# EAGLE schematic mazeModule (EAGLE 9.6.2)
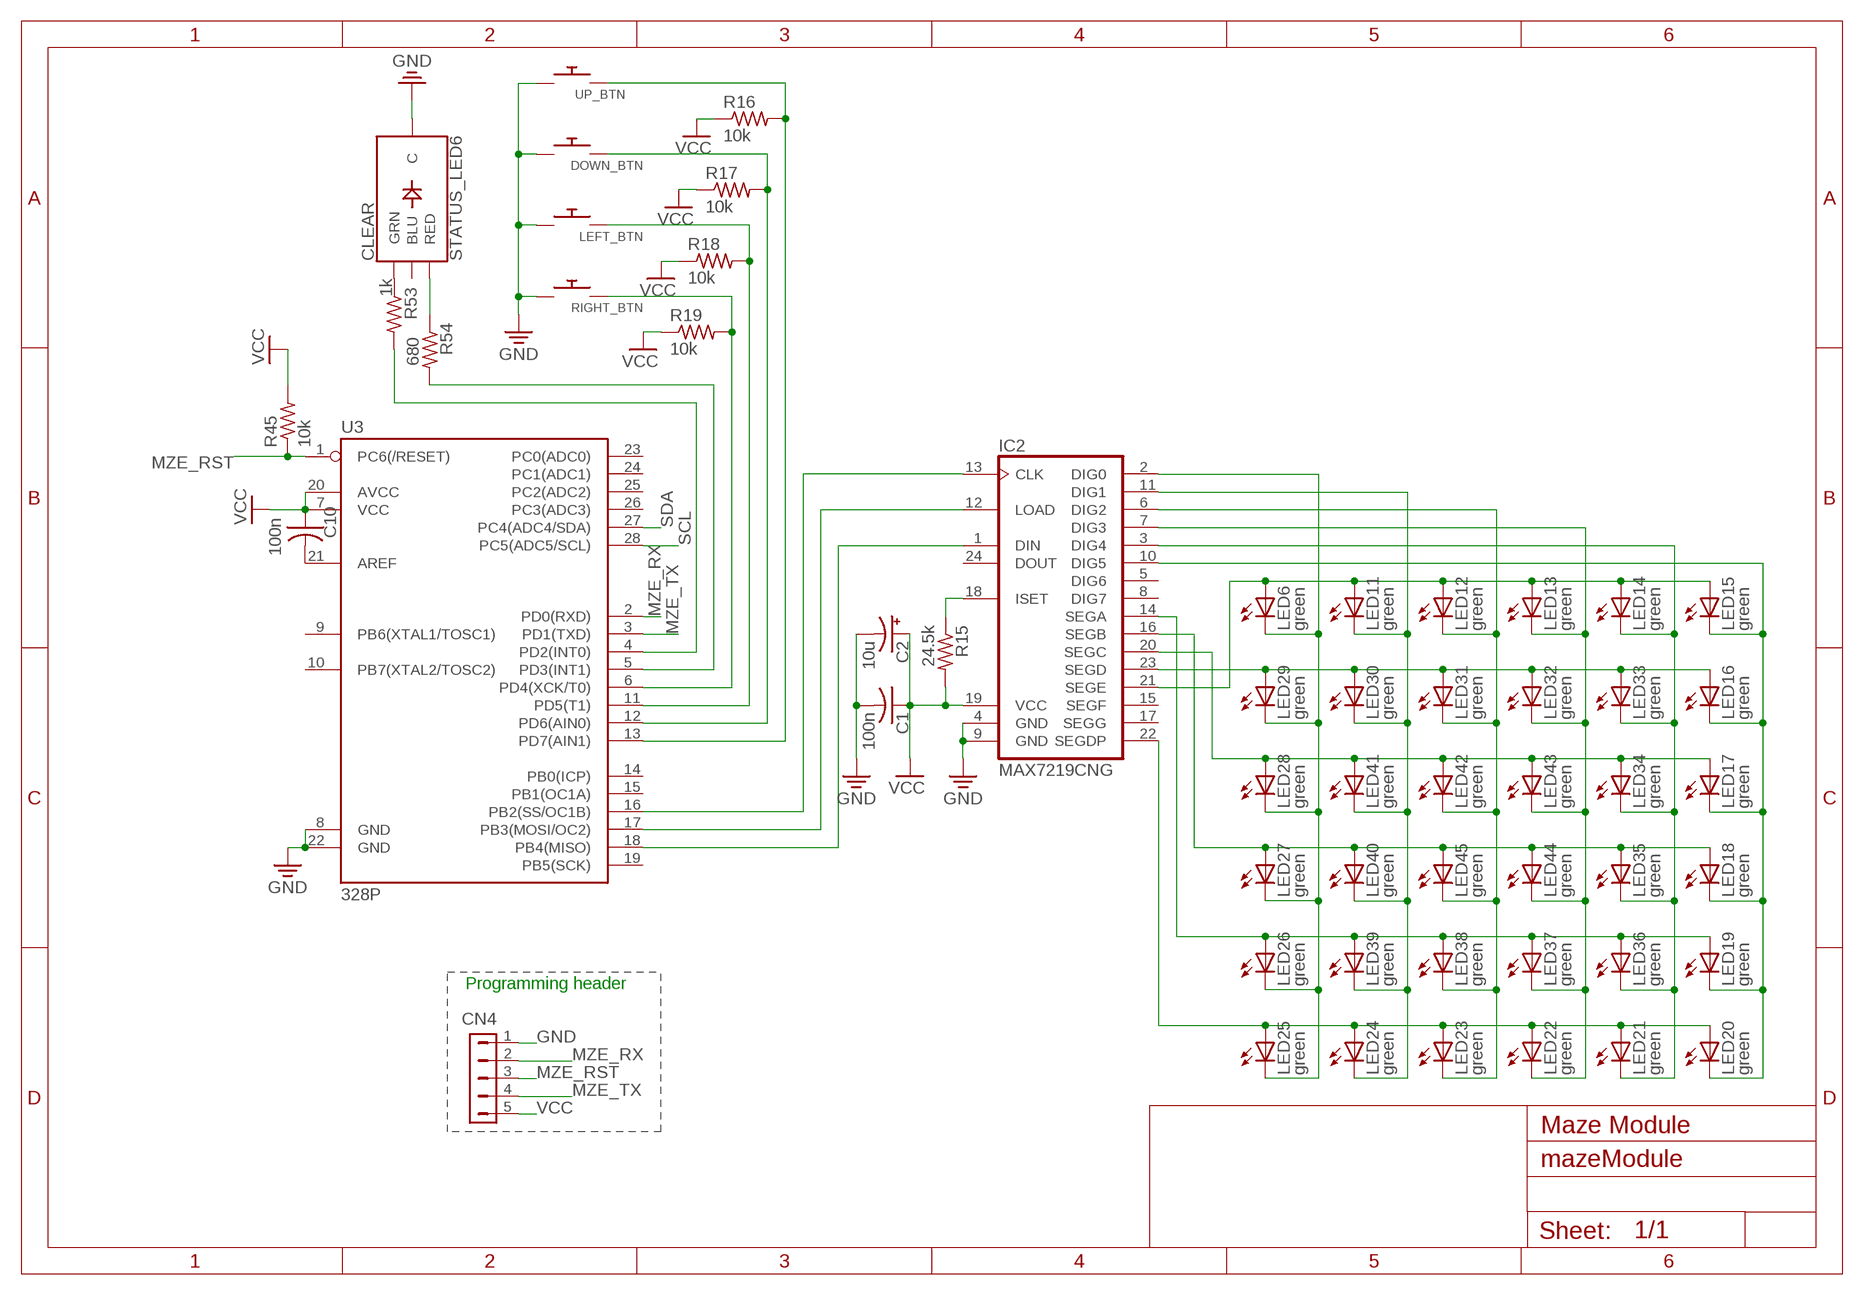
[diagram p0: schematic, sheet 1]

## Parts
C1  100n  C-US025-024X044  [C025-024X044]
C2  10u  CPOL-US085CS-1AR  [085CS_1AR]
C10  100n  C-US025-024X044  [C025-024X044]
CN4  HDR-1X5-SIP-100  [SIP-100-5V]
DOWN_BTN  SWITCH_PUSHBUTTONEVQ-PE  [TACT_PANA-EVQ]
IC2  MAX7219CNG  [DIL24-3]
LED6  green  LED5MM  [LED5MM]
LED11  green  LED5MM  [LED5MM]
LED12  green  LED5MM  [LED5MM]
LED13  green  LED5MM  [LED5MM]
LED14  green  LED5MM  [LED5MM]
LED15  green  LED5MM  [LED5MM]
LED16  green  LED5MM  [LED5MM]
LED17  green  LED5MM  [LED5MM]
LED18  green  LED5MM  [LED5MM]
LED19  green  LED5MM  [LED5MM]
LED20  green  LED5MM  [LED5MM]
LED21  green  LED5MM  [LED5MM]
LED22  green  LED5MM  [LED5MM]
LED23  green  LED5MM  [LED5MM]
LED24  green  LED5MM  [LED5MM]
LED25  green  LED5MM  [LED5MM]
LED26  green  LED5MM  [LED5MM]
LED27  green  LED5MM  [LED5MM]
LED28  green  LED5MM  [LED5MM]
LED29  green  LED5MM  [LED5MM]
LED30  green  LED5MM  [LED5MM]
LED31  green  LED5MM  [LED5MM]
LED32  green  LED5MM  [LED5MM]
LED33  green  LED5MM  [LED5MM]
LED34  green  LED5MM  [LED5MM]
LED35  green  LED5MM  [LED5MM]
LED36  green  LED5MM  [LED5MM]
LED37  green  LED5MM  [LED5MM]
LED38  green  LED5MM  [LED5MM]
LED39  green  LED5MM  [LED5MM]
LED40  green  LED5MM  [LED5MM]
LED41  green  LED5MM  [LED5MM]
LED42  green  LED5MM  [LED5MM]
LED43  green  LED5MM  [LED5MM]
LED44  green  LED5MM  [LED5MM]
LED45  green  LED5MM  [LED5MM]
LEFT_BTN  SWITCH_PUSHBUTTONEVQ-PE  [TACT_PANA-EVQ]
R15  24.5k  R-US_0309/12  [0309/12]
R16  10k  R-US_0309/12  [0309/12]
R17  10k  R-US_0309/12  [0309/12]
R18  10k  R-US_0309/12  [0309/12]
R19  10k  R-US_0309/12  [0309/12]
R45  10k  R-US_0309/12  [0309/12]
R53  1k  FLIPFLOP-RES  [0805-THM]
R54  680  FLIPFLOP-RES  [0805-THM]
RIGHT_BTN  SWITCH_PUSHBUTTONEVQ-PE  [TACT_PANA-EVQ]
STATUS_LED6  CLEAR  LED-RGB-CCCLEAR  [LED-RGB-THRU]
U3  328P  ATMEGA328P_PDIP  [DIP28]
UP_BTN  SWITCH_PUSHBUTTONEVQ-PE  [TACT_PANA-EVQ]

## Nets
GND: C1.2 C2.- CN4.1 DOWN_BTN.P$1 IC2.4(GND) IC2.9(GND) LEFT_BTN.P$1 RIGHT_BTN.P$1 STATUS_LED6.2(C) U3.8(GND) U3.22(GND) UP_BTN.P$1
MZE_RST: CN4.3 R45.1 U3.1(PC6(/RESET))
MZE_RX: CN4.2 U3.2(PD0(RXD))
MZE_TX: CN4.4 U3.3(PD1(TXD))
N$36: IC2.22(SEGDP) LED20.A LED21.A LED22.A LED23.A LED24.A LED25.A
N$40: IC2.14(SEGA) LED19.A LED26.A LED36.A LED37.A LED38.A LED39.A
N$41: IC2.16(SEGB) LED18.A LED27.A LED35.A LED40.A LED44.A LED45.A
N$42: IC2.20(SEGC) LED17.A LED28.A LED34.A LED41.A LED42.A LED43.A
N$49: IC2.2(DIG0) LED6.K(C) LED25.K(C) LED26.K(C) LED27.K(C) LED28.K(C) LED29.K(C)
N$50: IC2.21(SEGE) LED11.A LED12.A LED13.A LED14.A LED15.A
N$52: IC2.23(SEGD) LED16.A LED29.A LED30.A LED31.A LED32.A LED33.A
N$53: R16.2 U3.13(PD7(AIN1)) UP_BTN.P$2
N$54: IC2.11(DIG1) LED11.K(C) LED24.K(C) LED30.K(C) LED39.K(C) LED40.K(C) LED41.K(C)
N$55: IC2.6(DIG2) LED12.K(C) LED23.K(C) LED31.K(C) LED38.K(C) LED42.K(C) LED45.K(C)
N$56: IC2.7(DIG3) LED13.K(C) LED22.K(C) LED32.K(C) LED37.K(C) LED43.K(C) LED44.K(C)
N$57: IC2.3(DIG4) LED14.K(C) LED21.K(C) LED33.K(C) LED34.K(C) LED35.K(C) LED36.K(C)
N$58: IC2.10(DIG5) LED15.K(C) LED16.K(C) LED17.K(C) LED18.K(C) LED19.K(C) LED20.K(C)
N$59: DOWN_BTN.P$2 R17.2 U3.12(PD6(AIN0))
N$60: LEFT_BTN.P$2 R18.2 U3.11(PD5(T1))
N$61: IC2.18(ISET) R15.1
N$62: R19.2 RIGHT_BTN.P$2 U3.6(PD4(XCK/T0))
N$63: IC2.1(DIN) U3.18(PB4(MISO))
N$64: IC2.13(CLK) U3.16(PB2(SS/OC1B))
N$65: IC2.12(LOAD) U3.17(PB3(MOSI/OC2))
N$67: R54.2 U3.5(PD3(INT1))
N$68: R53.2 U3.4(PD2(INT0))
N$138: C10.2 U3.21(AREF)
N$149: R53.1 STATUS_LED6.3(GRN)
N$150: R54.1 STATUS_LED6.1(RED)
SCL: U3.28(PC5(ADC5/SCL))
SDA: U3.27(PC4(ADC4/SDA))
VCC: C1.1 C2.+ C10.1 CN4.5 IC2.19(VCC) R15.2 R16.1 R17.1 R18.1 R19.1 R45.2 U3.7(VCC) U3.20(AVCC)
VCC2: LED6.A
Unconnected: IC2.5(DIG6) IC2.8(DIG7) IC2.15(SEGF) IC2.17(SEGG) IC2.24(DOUT) STATUS_LED6.4(BLU) U3.9(PB6(XTAL1/TOSC1)) U3.10(PB7(XTAL2/TOSC2)) U3.14(PB0(ICP)) U3.15(PB1(OC1A)) U3.19(PB5(SCK)) U3.23(PC0(ADC0)) U3.24(PC1(ADC1)) U3.25(PC2(ADC2)) U3.26(PC3(ADC3))

## Notes on the sheet
- Programming header
- Maze Module

## Library data of the parts
C1 C10 = adafruit:C-US: CAPACITOR, American symbol
C2 = adafruit:CPOL-US: POLARIZED CAPACITOR, American symbol
CN4 = con-hdrs40:HDR-1X5: HEADER CONNECTOR
DOWN_BTN LEFT_BTN RIGHT_BTN UP_BTN = adafruit:SWITCH_PUSHBUTTON: Buttons SOFTTOUCHSMD_SJ - Soft touch temporary push button (Super Junk Akihabara) Compatible with SKPMANE010 [Mouser: 688-SKPMAN] C&K_KSS = Digikey: KSS221GLFS
IC2 = maxim:MAX7219CNG: LED DISPLAY DRIVER; MF: MAXIM; MPN: MAX7219CNG; OC_FARNELL: 1523914; OC_NEWARK: 34C4018
LED6 LED11-LED45 = adafruit:LED: LED OSRAM: - CHIPLED LG R971, LG N971, LY N971, LG Q971, LY Q971, LO R971, LY R971 LH N974, LH R974 LS Q976, LO Q976, LY Q976 LO Q996 - Hyper CHIPLED LW Q18S LB Q993, LB Q99A, LB R99A - SideLED LS A670, LO A670, LY A670, LG A670, LP A670 LB A673, LV A673, LT A673, LW A673 LH A674 LY A675 LS A676, LA A676, LO A676, LY A676, LW A676 LS A679, LY A679, LG A679 - Hyper Micro SIDELED® LS Y876, LA Y876, LO Y876, LY Y876 LT Y87S - SmartLED LW L88C, LW L88S LB L89C, LB L89S, LG L890 LS L89K, LO L89K, LY L89K LS L896, LA L896, LO L896, LY L896 - TOPLED LS T670, LO T670, LY T670, LG T670, LP T670 LSG T670, LSP T670, LSY T670, LOP T670, LYG T670 LG T671, LOG T671, LSG T671 LB T673, LV T673, LT T673, LW T673 LH T674 LS T676, LA T676, LO T676, LY T676, LB T676, LH T676, LSB T676, LW T676 LB T67C, LV T67C, LT T67C, LS T67K, LO T67K, LY T67K, LW E67C LS E67B, LA E67B, LO E67B, LY E67B, LB E67C, LV E67C, LT E67C LW T67C LS T679, LY T679, LG T679 LS T770, LO T770, LY T770, LG T770, LP T770 LB T773, LV T773, LT T773, LW T773 LH T774 LS E675, LA E675, LY E675, LS T675 LS T776, LA T776, LO T776, LY T776, LB T776 LHGB T686 LT T68C, LB T68C - Hyper Mini TOPLED® LB M676 - Mini TOPLED Santana® LG M470 LS M47K, LO M47K, LY M47K Source: http://www.osram.convergy.de/
R15-R19 R45 = adafruit:R-US_: RESISTOR, American symbol
R53 R54 = adafruit:FLIPFLOP-RES: Flip Flop resistor An 0805 resistor inside a standard 1/4W 5% resistor. Makes for easy mods
STATUS_LED6 = SparkFun-LED:LED-RGB-CC: LED-RGB Common Cathode Packages: LED RGB-THRU LED_PIRANHA_5MM SparkFun Products: RGB Diffused Common Cathode- Diffuse <[https://www.sparkfun.com/products/9264]> RGB Diffused Common Cathode - Clear <[https://www.sparkfun.com/products/105]> LED-RGB 5mm Square (Piranha) <[https://www.sparkfun.com/products/11679]>; PROD_ID: DIO-08418
U3 = SparkFun-IC-Microcontroller:ATMEGA328P_PDIP: Atmel 328P Through hole ATMEGA328P uC used in the Arduino 32kb flash, 1k EEPROM, 2k SRAM Datasheet <http://www.sparkfun.com/datasheets/Components/SMD/ATMega328.pdf> SparkFun Products Storefront component: AVR 28 Pin 20MHz 32K 6A/D - ATMega328P <https://www.sparkfun.com/products/9061> (COM-09061) SparkFun Simon Says - Through-Hole Soldering Kit <https://www.sparkfun.com/products/10547> (KIT-10547) SparkFun Learn to Solder - Simon Says <https://www.sparkfun.com/products/13708> (KIT-13708) SparkFun BigTime Watch Kit <https://www.sparkfun.com/products/11734> (KIT-11734) SparkFun ClockIt <https://www.sparkfun.com/products/10930> (KIT-10930) SparkFun Serial Enabled LCD Kit <https://www.sparkfun.com/products/10097> (LCD-10097) SparkFun Simon Tilts - Through Hole Soldering Kit <https://www.sparkfun.com/products/12634> (KIT-12634) SparkFun Frequency Counter Kit <https://www.sparkfun.com/products/10140> (KIT-10140) FabFM Radio Kit <https://www.sparkfun.com/products/11043> (KIT-11043) SparkFun Binary Blaster Kit <https://www.sparkfun.com/products/12037> (KIT-12037) SparkFun Metro-Gnome <https://www.sparkfun.com/products/9236> (KIT-09236) ATmega328 with Arduino Optiboot (Uno) <https://www.sparkfun.com/products/10524> (DEV-10524); PROD_ID: IC-09136